# Altium project Variable Voltage Converter.PrjPcb
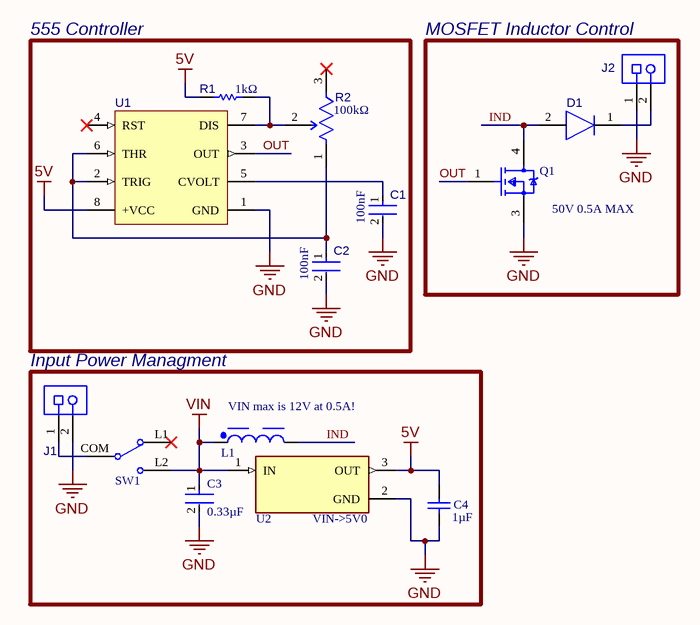
[diagram p0: Main.SchDoc]
1 sheet, 14 parts. Net scope: global (net labels, ports and power ports of the same name join across sheets).
Board file: Main.PcbDoc

## Sheet Main.SchDoc
size B; SheetNumber: 1; SheetTotal: 1; SPICEModelCacheMEBBXAVL: <root> / <DocumentId>MEBBXAVL</DocumentId> / <CacheFrame Number="0"> / <Model Name="7345_784777047_4.7u" Kind="CKT"> / <Text>******* / .subckt 7345_784777047_4.7u 1 2 / Rp 1 2 8557.586509961 / Cp 1 2 1.4744181502p / Rs 1 N3 0.07 / L1 N3 2 4.187187927039u / .ends 7345_784777047_4.7u</Text> / </Model> / </CacheFrame> / </root>

### Parts
C1  100nF  [FP-1206-L_3_2_0_2-W_1_6_0-MFG]
C2  100nF  [FP-1206-L_3_2_0_2-W_1_6_0-MFG]
C3  0.33µF  [FP-C1206C-EB-MFG]
C4  1µF  [CAPC3216X110X50LL20T25]
D1  S1B-13-F  [FP-SMA-MFG]  (value not drawn)
J1  1729128  [PHOE-1729128-2_V]  (value not drawn)
J2  1729128  [PHOE-1729128-2_V]  (value not drawn)
L1  4.7uH  [WE-PDA_7345]  (value not drawn)
Q1  IRLZ44NSTRLPBF  [FP-PG-TO263-3-MFG]  (value not drawn)
R1  1kΩ  [RESC3116X65X50LL20T20]
R2  100kΩ  [FP-3362P-T-MFG]
SW1  450301014042  [450301014042]  (value not drawn)
U1  555 Timer IC  [D0008A_M]  (value not drawn)
U2  VIN->5V0  [DPAK229P990X238-4N]

### Blocks framed on the sheet
555 Controller: C1 C2 R1 R2 U1
MOSFET Inductor Control: D1 J2 Q1
Input Power Managment: C3 C4 J1 L1 SW1 U2

### Nets
5V: C4.1 R1.2 U1.8(+VCC) U2.3(OUT)
GND: C1.2 C2.2 C3.2 C4.2 J1.2 J2.1 Q1.3(S) U1.1(GND) U2.2(GND)
VIN: C3.1 L1.1 SW1.L2 U2.1(IN)
IND: D1.2(A) L1.2 Q1.4(D)
OUT: Q1.1(G) U1.3(OUT)
NetC1_1: C1.1 U1.5(CVOLT)
NetC2_1: C2.1 R2.1(CCW) U1.2(TRIG) U1.6(THR)
NetD1_1: D1.1(C) J2.2
NetJ1_1: J1.1 SW1.COM
NetR1_1: R1.1 R2.2(WIPER) U1.7(DIS)

Not connected (* = marked no-connect by the designer): R2 3(CW)*; SW1 L1*; U1 4(RST)*

### Notes on the sheet
- (near Q1) 50V 0.5A MAX
- (near L1) VIN max is 12V at 0.5A!

### Library data of the parts
C1 C2 = CMP-04427-004798-1: General Purpose Ceramic Capacitor, 1206, 100nF, 10%, X7R, 15%, 100V; Features: Soft Termination; Termination: SMD/SMT; Mount: Surface Mount; Tolerance: 10%; Voltage Rating: 100V; Length: 3.2mm; Case/Package: 1206; Case Code (Metric): 3216; RoHS Compliant: Yes; Package Quantity: 1; Max Operating Temperature: 125°C; Voltage Rating (DC): 100V; Min Operating Temperature: -55°C; Number of Pins: 2; Packaging: Tape and Reel; Width: 0.063inch; REACH SVHC: No SVHC; Lead Free: Lead Free; Construction: Flat; Capacitance: 100nF; Radiation Hardening: No; Case Code (Imperial): 1206; Thickness: 0.05inch; Series: FLEXITERM®; Depth: 1.6mm; Dielectric: X7R
C3 = CMP-1037-04487-2: CAP CER 0.33UF 50V X7R 1206; Manufacturer Part Number: C1206C334K5RACTU; Manufacturer: KEMET; Tolerance: 0.1; Automotive Grade: Grade 0; Material: Ceramic; Temperature Coefficient: 15%; Ipc Land Pattern Name: CAPC320160X78; Octopart: https://octopart.com/c1206c334k5ractu-kemet-146059; Height: 0.88mm; Package: C1206C-EB; ComponentLink2Description: Datasheet; Digikey Description: CAP CER 0.33UF 50V X7R 1206; Voltage Rating: 50 V; Temperature Range High: +150°C; Temperature: -55°C to +150°C; Automotive: Yes; Lead Free: Yes; Mouser Description: Multilayer Ceramic Capacitors MLCC - SMD/SMT 50volts 0.33uF X7R 10%; Category: Cap; RoHS: TRUE; Temperature Characteristic: X7R; Value: 0.33 μF; Capacitance: 0.33 μF; Device Class L1: Passive Components; Temperature Range Low: -55°C; Device Class L2: Capacitors; Device Class L3: Ceramic Capacitors; ComponentLink2URL: https://content.kemet.com/datasheets/KEM_C1007_X8R_ULTRA_150C_SMD.pdf
C4 = CMP-2000-06011-1: Chip Capacitor, 1 uF, +/- 10%, 50 V, -55 to 125 degC, 1206 (3216 Metric), RoHS, Tape and Reel; Manufacturer: Kemet; Case Height: 1mm; Dielectric: X7R; Voltage Rating: 50V; Capacitance: 1uF; Temperature Coefficient / Code: +/-15%; Case Length: 3.2mm; Case Width: 1.6mm; Type: SMDMLCCX7R6.3-250VDCCommericalGrade; Class: Class1; Capacitance - nF: 1000nF; Datasheet URL: http://www.kemet.com/docfinder?Partnumber=C1206C105K5RACTU; Product Category: MultilayerCeramicCapacitorsMLCC-SMD/SMT; Termination Style: SMD/SMT; Dimensions: 1.6mmWx3.2mmLx1mmH; Voltage Rating DC: 50V; Datasheet Version: 02/2016; Packaging: Reel; Brand: Kemet; RoHS: Details; Minimum Operating Temperature: -55C; Operating Temperature Range: -55Cto+125C; Package Reference: 1206; Manufacturer URL: http://www.kemet.com/; Product: GeneralTypeMLCCs; Tolerance: 10%; Package Description: 2-Pin Surface Mount Device, Body 3.2 x 1.6 mm; Mounting Technology: SurfaceMount; Case Code - mm: 3216; Maximum Operating Temperature: +125C; Series: C1206C; Factory Pack Quantity: 2500; Package / Case: 1206(3216metric); Case Code - in: 1206
D1 = CMP-12791-000051-1: DIODE GEN PURP 100V 1A SMA; Peak Non-Repetitive Surge Current: 30A; Element Configuration: Single; Recovery Time: 1.8us; Peak Reverse Current: 5uA; Forward Voltage: 1.1V; Capacitance: 10pF; Polarity: Standard; Reverse Recovery Time: 3us; Output Current: 1A; Width: 2.92mm; Current Rating: 1A; Max Surge Current: 30A; Length: 4.6mm; Contact Plating: Tin; Radiation Hardening: No; Max Repetitive Reverse Voltage (Vrrm): 100V; Min Operating Temperature: -65°C; Forward Current: 1A; Lead Free: Lead Free; Weight: 0.002258oz; Mount: Surface Mount; Number of Pins: 2; Packaging: Tape and Reel; Reverse Voltage (DC): 100V; Max Operating Temperature: 150°C; Termination: SMD/SMT; Max Reverse Voltage (DC): 100V; Voltage Rating (DC): 100V; Package Quantity: 5000; Average Rectified Current: 1A; Height: 2.1mm; Case/Package: SMA
J1 J2 = CMP-2000-05815-1: PCB Terminal Block, 13.5 A, 400 V, 2-Pin THD, RoHS, Bulk; Manufacturer: Phoenix Contact; Package Version: 03/2015; No. of Rows: 1; Pitch: 5.08mm; No. of Positions: 2; Voltage Rating: 400V; Current Rating: 13500mA; Manufacturer URL: http://www.phoenixcontact.com/; Datasheet URL: https://datasheet.ciiva.com/16046/1729128-16046181.pdf; RoHS: TRUE; Package URL: https://www.phoenixcontact.com/online/portal/pi/pxc/product_detail_page/!ut/p/b1/3VdJjqNKFDxLH8AFycySyWY2ozFsEPOMMQaDOX1XedGL_1Vdm5YXJleknhSKeBkvI6EA8ncAo3AYoDhBQGco6KN7VURTdemj9us_IEKEZo_YHiPAEWEFmDGOHMORkqKYCORBZxgL7ZoaZYcbFFUZ3fqxSY6GOuxydWUuHqz1ynmMFygu583Bob0Ewr6Sd_l-5m-kAueHiB0jpRwZwe58wwtkpxtMYd_LmGcDRU02dRNEyWt6Y2ti5pSyJ_reIkzIulrqApdnbT11V5jnCKbYNCvhEM1MCpPByat_X379-iThf08CI5GfOPqfBeS3BRoBOdD55AKVv0iLwCMq-2BrzXWSGRH7pUGD9uwXQjiph3xL0DKQwdGa0JImiIOmBNOestqgwTHSSs2oOep-78apyXQBvNi8ZLaFjvjWvcaUEBu0MC6Wbe-d6mB0FAebo2lUWinqYaZs5DAYzV0RP9yitUjnGJ0iI9xhZkT42OCQNUJJhkgWINNQLP2JFP6OpMg3JCVg70jqHT0lvKOnhHf0lPuOnnLf0VPuWx6_dxwUIvwk5WMkT0kLL1mh61l2yZVSzG3pYV_bqo-mj6uMKwKwdnnW8Jh5RTOJzMOA5c-eJDaZQw4mTMPH02PvS_ZAqNVjVTo2WyYLkwH_KU1mmmG5kjRhDqPXLwwVHvVOjCM60-fpXvTDfMGW1PVFVS1r4e4yVDk4ZdNbkUHvqPqQSeian4UD39fNKmachqdJ1NJbyk8rXT9mXTvPk3oE5meulKGgiruPJek-4I9hTT6G8ZLOyRSm2RRVbThERQad5OS28hdt4YW4vG0stgYYzsWsK4_7y6DZMjJSCqri1kyiZR5vD7pwIrNR7QwPHTcLTI5qT7eRlpHrdGiupYlqQDJ7zy_CND8fWWBoLRXxk1RVcXiBQwbTD4Xi7KL-FuO94t9xaqweXzH; PartNumber: 1729128; Package Description: 2-Pin Through Hole Device, Body 8.1 x 10.16 mm, Pitch 5.08 mm; Datasheet Version: 12/2013; Mounting Technology: ThroughHole; Orientation: Horizontal; Package Reference: 1729128-2; Packing: Bulk
L1 = 784777047: WE-PDA SMT Shielded Power Inductor, size 7345, 4.7uH, 2.35A, 84mOhm; Manufacturer: Wurth Elektronik; Case/Size Code: 7345; DC Resistance: 70mOhm; Saturation Current: 3.7A; Self Resonant Frequency: 64.7MHz; Manufacturer Part Number: 784777047; Category: Power Inductors; Match Code: WE-PDA; ComponentLink1Description: Website Link; ComponentLink1URL: https://www.we-online.com/redexpert/article/784777047?ad; ComponentLink2Description: Datasheet Link; ComponentLink2URL: https://www.we-online.com/redexpert/spec/784777047?ad; Mount: Surface Mount; Operating Temperature Max: 125°C; Operating Temperature Min: -40°C; Packaging: Tape and Reel; Length: 7.3mm; Width: 7.3mm; Height: 4mm; Automotive: Yes; DC Resistance Max: 84mOhm; Inductance: 4.7uH; Rated Current: 2.35A
Q1 = CMP-32901-000495-1: MOSFET N-CH 55V 47A D2PAK; Rds On Max: 22mR; Input Capacitance: 1.7nF; Turn-On Delay Time: 11ns; Turn-Off Delay Time: 26ns; Power Dissipation: 110W; Element Configuration: Single; Gate to Source Voltage (Vgs): 16V; Drain to Source Resistance: 35mR; Threshold Voltage: 2V; Max Power Dissipation: 3.8W; Lead Free: Contains Lead; Max Dual Supply Voltage: 55V; Width: 0.38inch; Mount: Surface Mount; Continuous Drain Current (ID): 47A; Min Operating Temperature: -55°C; Number of Pins: 3; REACH SVHC: No SVHC; Height: 0.19inch; Length: 0.42inch; Case/Package: D2PAK; Drain to Source Breakdown Voltage: 55V; Packaging: Tape and Reel; Drain to Source Voltage (Vdss): 55V; Halogen Free: Halogen Free; RoHS Compliant: Yes; Max Operating Temperature: 175°C
R1 = CMP-2003-04880-1: Part Number: CRCW12061K00JNEAHP; Manufacturer: Vishay Dale
R2 = CMP-07234-000031-1: TRIMMER 100K OHM 0.5W PC PIN TOP; Max Power Dissipation: 500mW; Temperature Coefficient: 100ppm/°C; Resistance: 100kR; Tolerance: 10%; Termination: PC Pin; Width: 0.26inch; RoHS Compliant: Yes; Power Rating: 500mW; Technology: CERMET; Mount: Through Hole; Length: 0.275inch; Resistor Type: Cermet; Package Quantity: 50; Height: 0.185inch; Series: Trimpot® 3362 - Sealed; Max Operating Temperature: 125°C; Packaging: Rail/Tube; Min Operating Temperature: -55°C
SW1 = 450301014042: WS-SLTV THT Mini Slide Switch, Opposite Side Connection, SPDT, 12VDC, 500mA, 800g; Manufacturer: Wurth Elektronik; ComponentLink1Description: Website Link; ComponentLink1URL: https://www.we-online.com/redexpert/article/450301014042?ad; ComponentLink2Description: Datasheet Link; ComponentLink2URL: https://www.we-online.com/redexpert/spec/450301014042?ad; Manufacturer Part Number: 450301014042; Category: Slide Switches; Match Code: WS-SLTV; Mount: Through Hole; Operating Temperature Max: 85°C; Operating Temperature Min: -40°C; Packaging: Bulk; Length: 10mm; Width: 2.5mm; Height: 6.4mm; Circuit: SPDT; Contact Material: Copper Alloy; Contact Plating: Gold; Operation Force: 800g; Rated Current: 500mA; Rated Voltage: 12VDC; Terminal Material: Copper Alloy; Terminal Plating: Gold
U1 = CMP-0056-00105-3: Timer, 8-pin Narrow SOIC, Pb-Free; Manufacturer: Texas Instruments; PowerWise: N; CompType: Analog IC; PackageTopMarking: NSZXTT*LM*555CM; PinCount: 8; PackageDescription: SOIC Narrow, 4.9 x 3.9 x 1.45mm, 8 Lead, 1.27mm Pitch; RoHS: Y; ComponentLink1Description: Datasheet URL; ComponentLink1URL: http://www.ti.com/general/docs/lit/getliterature.tsp?genericPartNumber=LM555&fileType=pdf; PackageReference: D0008A; Code_JEDEC: MS-012-AA; Code_IPC: SOIC127P600-8
U2 = MC7805BDTRKG: Linear Voltage Regulator IC 1 Output 1A DPAK; MF: ON Semiconductor; MP: MC7805BDTRKG; Package: TO-252-3 Freescale Semiconductor; Price: None; Availability: Unavailable; Value: *; SnapEDA_Link: https://www.snapeda.com/parts/MC7805BDTRKG/ON%20Semiconductor/view-part/360207/?ref=snap